# EAGLE design manga-screen (EAGLE 5.12)
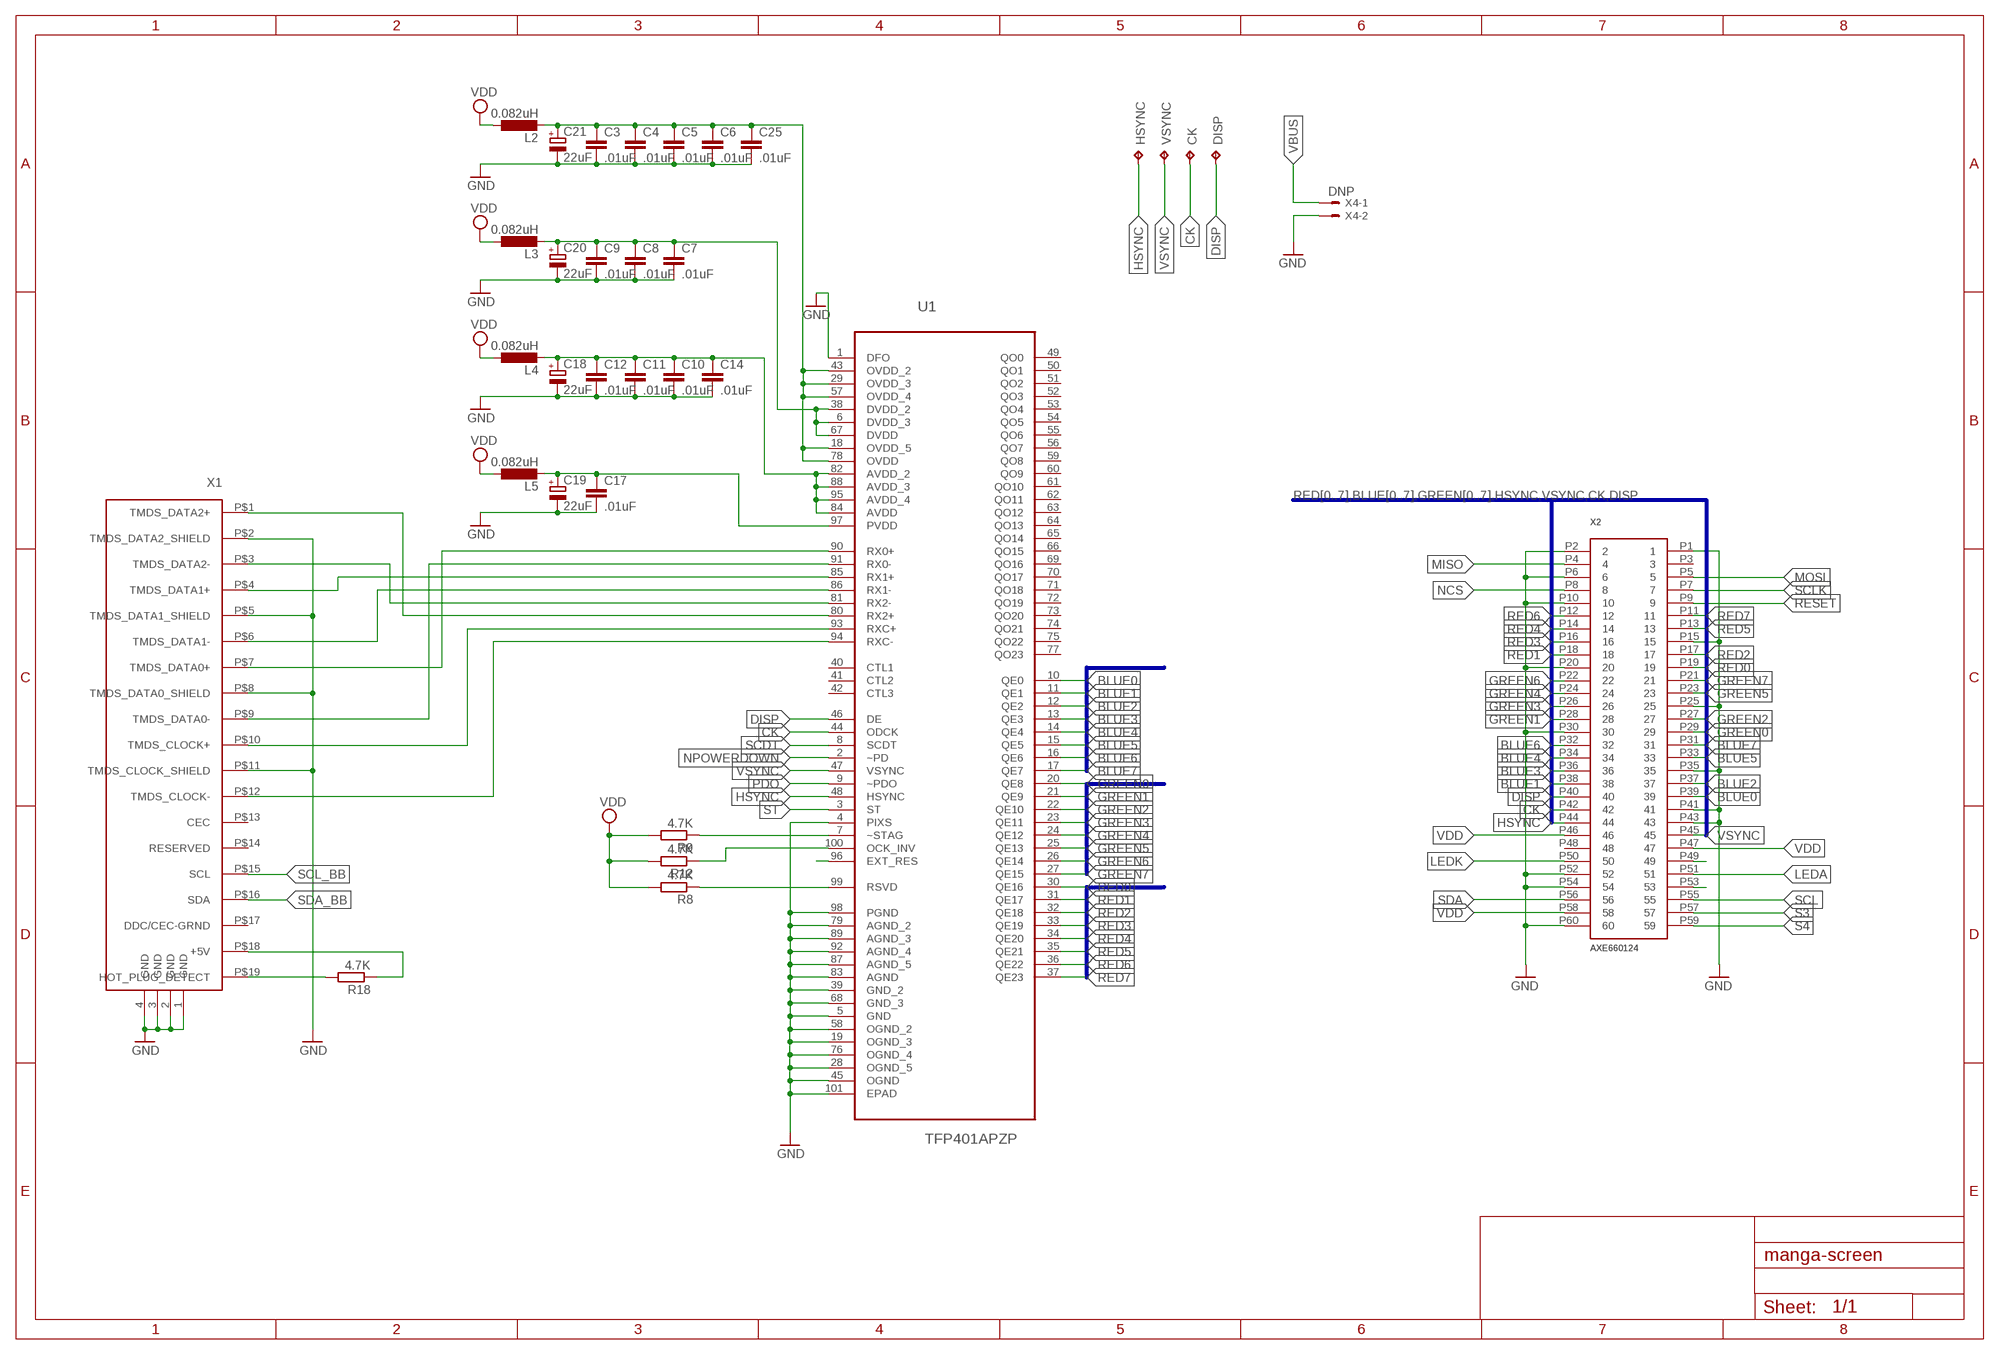
[diagram p0: schematic, sheet 1, part 1 of 2]
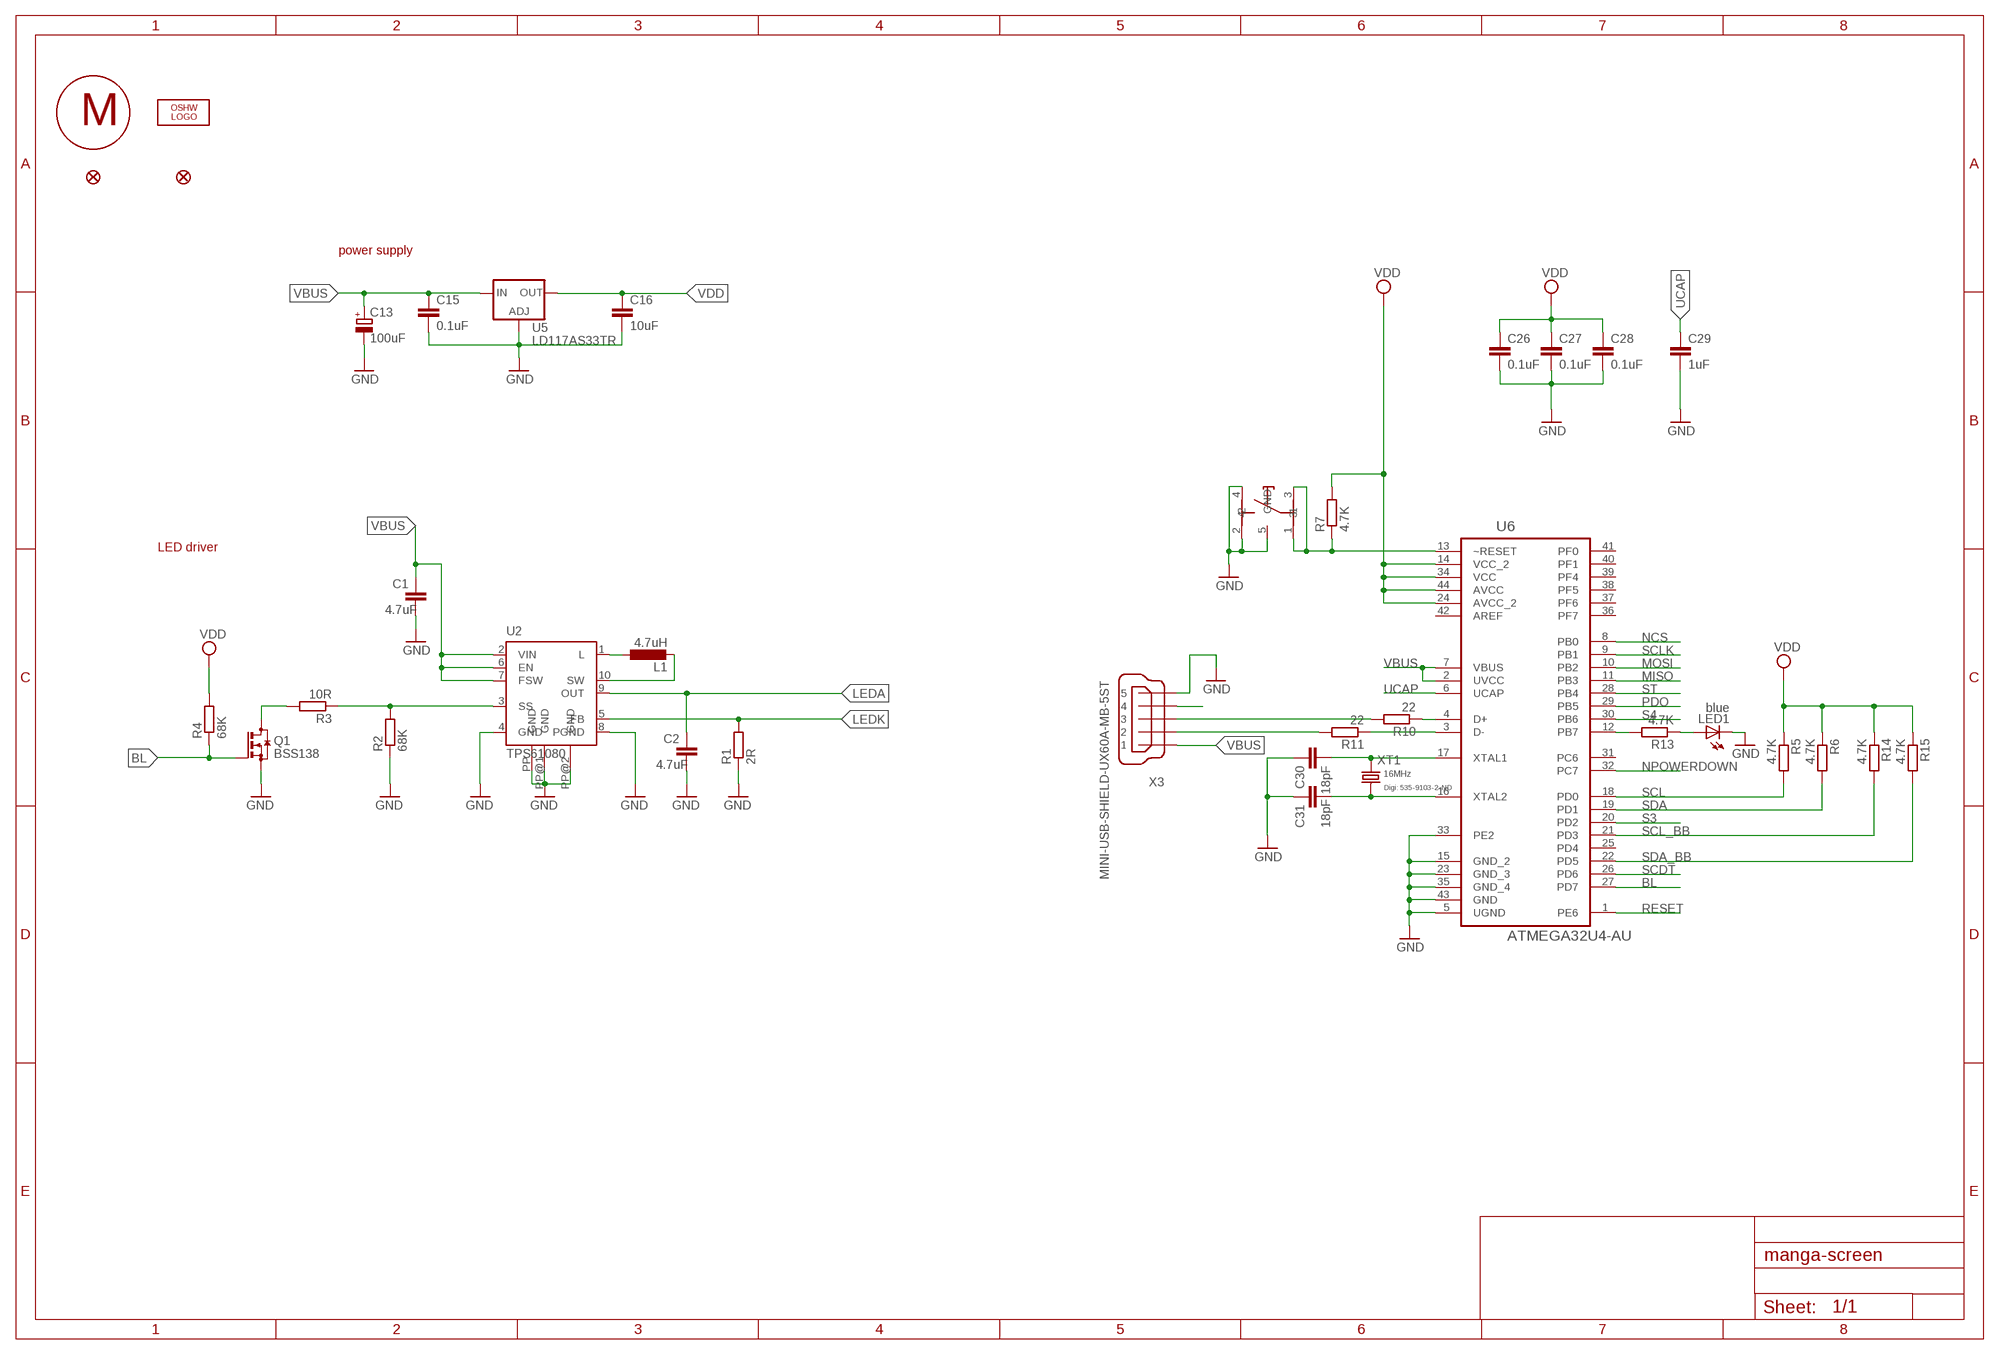
[diagram p1: schematic, sheet 1, part 2 of 2]

## Parts
C1  4.7uF  C-EUC0402  [C0402]
C2  4.7uF  C-EUC0402  [C0402]
C3  .01uF  C-EUC0402  [C0402]
C4  .01uF  C-EUC0402  [C0402]
C5  .01uF  C-EUC0402  [C0402]
C6  .01uF  C-EUC0402  [C0402]
C7  .01uF  C-EUC0402  [C0402]
C8  .01uF  C-EUC0402  [C0402]
C9  .01uF  C-EUC0402  [C0402]
C10  .01uF  C-EUC0402  [C0402]
C11  .01uF  C-EUC0402  [C0402]
C12  .01uF  C-EUC0402  [C0402]
C13  100uF  CPOL-EUB  [PANASONIC_B]
C14  .01uF  C-EUC0402  [C0402]
C15  0.1uF  C-EUC0402  [C0402]
C16  10uF  C-EUC0805  [C0805]
C17  .01uF  C-EUC0402  [C0402]
C18  22uF  CPOL-EUCT3216  [CT3216]
C19  22uF  CPOL-EUCT3216  [CT3216]
C20  22uF  CPOL-EUCT3216  [CT3216]
C21  22uF  CPOL-EUCT3216  [CT3216]
C25  .01uF  C-EUC0402  [C0402]
C26  0.1uF  C-EUC0402  [C0402]
C27  0.1uF  C-EUC0402  [C0402]
C28  0.1uF  C-EUC0402  [C0402]
C29  1uF  C-EUC0402  [C0402]
C30  18pF  C-EUC0402  [C0402]
C31  18pF  C-EUC0402  [C0402]
CK  TPB1,27  [B1,27]
DISP  TPB1,27  [B1,27]
HSYNC  TPB1,27  [B1,27]
JP1  FIDUCIAL1X2  [FIDUCIAL-1X2]
JP2  FIDUCIAL1X2  [FIDUCIAL-1X2]
L1  4.7uH  L-EUL2825P  [L2825P]
L2  0.082uH  L-EUL2012C  [L2012C]
L3  0.082uH  L-EUL2012C  [L2012C]
L4  0.082uH  L-EUL2012C  [L2012C]
L5  0.082uH  L-EUL2012C  [L2012C]
LED1  blue  LEDCHIP-LED0603  [CHIP-LED0603]
LOGO2  OSHW_LOGO_10MILX0200-NT  [OSHW_10X200_NOTEXT]
Q1  BSS138  BSS123  [SOT23]
R1  2R  R-EU_R0402  [R0402]
R2  68K  R-EU_R0402  [R0402]
R3  10R  R-EU_R0402  [R0402]
R4  68K  R-EU_R0402  [R0402]
R5  4.7K  R-EU_R0402  [R0402]
R6  4.7K  R-EU_R0402  [R0402]
R7  4.7K  R-EU_R0402  [R0402]
R8  4.7K  R-EU_R0402  [R0402]
R9  4.7K  R-EU_R0402  [R0402]
R10  22  R-EU_R0402  [R0402]
R11  22  R-EU_R0402  [R0402]
R12  4.7K  R-EU_R0402  [R0402]
R13  4.7K  R-EU_R0402  [R0402]
R14  4.7K  R-EU_R0402  [R0402]
R15  4.7K  R-EU_R0402  [R0402]
R18  4.7K  R-EU_R0402  [R0402]
S1  KRM_TACT_SWITCH  [KMR]
U1  TFP401APZP  [QFP50P1600X1600X120-101N]
U2  TPS61080  [S-PDSO-N10]
U5  LD117AS33TR  [SOT223]
U6  ATMEGA32U4-AU  [QFP80P1200X1200X120-44N]
U$2  MANGA-GRAPHIC  [MANGA]
VSYNC  TPB1,27  [B1,27]
X1  HDMI  [FCI-HDMI]
X2  AXE660124  AXE660124SOCKET  [AXE560124]
X3  MINI-USB-SHIELD-UX60A-MB-5ST  [UX60A-MB-5ST]
X4  DNP  22-27-2021-02  [6410-02]
XT1  16MHz  CRYSTAL-5.08X3.18  [2P-SMD-5.08X3.18]

## Nets
BL: Q1.1(G) R4.1 U6.27(PD7)
BLUE0: U1.10(QE0) X2.P39
BLUE1: U1.11(QE1) X2.P38
BLUE2: U1.12(QE2) X2.P37
BLUE3: U1.13(QE3) X2.P36
BLUE4: U1.14(QE4) X2.P34
BLUE5: U1.15(QE5) X2.P33
BLUE6: U1.16(QE6) X2.P32
BLUE7: U1.17(QE7) X2.P31
CK: CK.TP U1.44(ODCK) X2.P42
D+: R10.2 X3.3
D-: R11.2 X3.2
DISP: DISP.TP U1.46(DE) X2.P40
DM: R11.1 U6.3(D-)
DP: R10.1 U6.4(D+)
GND: C1.2 C2.2 C3.2 C4.2 C5.2 C6.2 C7.2 C8.2 C9.2 C10.2 C11.2 C12.2 C13.- C14.2 C15.2 C16.2 C17.2 C18.- C19.- C20.- C21.- C25.2 C26.2 C27.2 C28.2 C29.2 C30.1 C31.1 LED1.C Q1.2(S) R1.1 R2.1 S1.2 S1.4 S1.5(GND) U1.1(DFO) U1.4(PIXS) U1.5(GND) U1.19(OGND_3) U1.28(OGND_5) U1.39(GND_2) U1.45(OGND) U1.58(OGND_2) U1.68(GND_3) U1.76(OGND_4) U1.79(AGND_2) U1.83(AGND) U1.87(AGND_5) U1.89(AGND_3) U1.92(AGND_4) U1.98(PGND) U1.101(EPAD) U2.4(GND) U2.8(PGND) U2.PP(GND) U2.PP@1(GND) U2.PP@2(GND) U5.1(ADJ) U6.5(UGND) U6.15(GND_2) U6.23(GND_3) U6.33(PE2) U6.35(GND_4) U6.43(GND) X1.1(GND) X1.2(GND) X1.3(GND) X1.4(GND) X1.P$2(TMDS_DATA2_SHIELD) X1.P$5(TMDS_DATA1_SHIELD) X1.P$8(TMDS_DATA0_SHIELD) X1.P$11(TMDS_CLOCK_SHIELD) X2.P1 X2.P2 X2.P6 X2.P10 X2.P15 X2.P20 X2.P25 X2.P30 X2.P35 X2.P41 X2.P43 X2.P52 X2.P54 X2.P60 X3.5 X4.2
GREEN0: U1.20(QE8) X2.P29
GREEN1: U1.21(QE9) X2.P28
GREEN2: U1.22(QE10) X2.P27
GREEN3: U1.23(QE11) X2.P26
GREEN4: U1.24(QE12) X2.P24
GREEN5: U1.25(QE13) X2.P23
GREEN6: U1.26(QE14) X2.P22
GREEN7: U1.27(QE15) X2.P21
HSYNC: HSYNC.TP U1.48(HSYNC) X2.P44
LEDA: C2.1 U2.9(OUT) X2.P51
LEDK: R1.2 U2.5(FB) X2.P50
MISO: U6.11(PB3) X2.P4
MOSI: U6.10(PB2) X2.P5
N$1: L1.1 U2.1(L)
N$2: L1.2 U2.10(SW)
N$3: R12.1 U1.100(OCK_INV)
N$4: R2.2 R3.1 U2.3(SS)
N$6: Q1.3(D) R3.2
N$7: R7.1 S1.1 S1.3 U6.13(~RESET)
N$8: R13.2 U6.12(PB7)
N$9: LED1.A R13.1
N$10: R9.1 U1.7(~STAG)
N$11: R8.1 U1.99(RSVD)
N$12: X2.P53
N$13: X2.P49
N$14: C31.2 U6.16(XTAL2) XT1.X2
N$15: X3.4
N$16: C30.2 U6.17(XTAL1) XT1.X1
N$17: R18.1 X1.P$18(+5V)
N$19: C7.1 C8.1 C9.1 C20.+ L3.2 U1.6(DVDD_3) U1.38(DVDD_2) U1.67(DVDD)
N$20: C3.1 C4.1 C5.1 C6.1 C21.+ C25.1 L2.2 U1.18(OVDD_5) U1.29(OVDD_3) U1.43(OVDD_2) U1.57(OVDD_4) U1.78(OVDD)
N$21: C10.1 C11.1 C12.1 C14.1 C18.+ L4.2 U1.82(AVDD_2) U1.84(AVDD) U1.88(AVDD_3) U1.95(AVDD_4)
N$22: C17.1 C19.+ L5.2 U1.97(PVDD)
N$23: U1.96(EXT_RES)
N$31: R18.2 X1.P$19(HOT_PLUG_DETECT)
NCS: U6.8(PB0) X2.P8
NPOWERDOWN: U1.2(~PD) U6.32(PC7)
PDO: U1.9(~PDO) U6.29(PB5)
RED0: U1.30(QE16) X2.P19
RED1: U1.31(QE17) X2.P18
RED2: U1.32(QE18) X2.P17
RED3: U1.33(QE19) X2.P16
RED4: U1.34(QE20) X2.P14
RED5: U1.35(QE21) X2.P13
RED6: U1.36(QE22) X2.P12
RED7: U1.37(QE23) X2.P11
RESET: U6.1(PE6) X2.P9
S3: U6.20(PD2) X2.P57
S4: U6.30(PB6) X2.P59
SCDT: U1.8(SCDT) U6.26(PD6)
SCL: R5.2 U6.18(PD0) X2.P55
SCL_BB: R14.2 U6.21(PD3) X1.P$15(SCL)
SCLK: U6.9(PB1) X2.P7
SDA: R6.2 U6.19(PD1) X2.P56
SDA_BB: R15.2 U6.22(PD5) X1.P$16(SDA)
ST: U1.3(ST) U6.28(PB4)
TMDS_CLOCK+: U1.93(RXC+) X1.P$10(TMDS_CLOCK+)
TMDS_CLOCK-: U1.94(RXC-) X1.P$12(TMDS_CLOCK-)
TMDS_DATA0+: U1.90(RX0+) X1.P$7(TMDS_DATA0+)
TMDS_DATA0-: U1.91(RX0-) X1.P$9(TMDS_DATA0-)
TMDS_DATA1+: U1.85(RX1+) X1.P$4(TMDS_DATA1+)
TMDS_DATA1-: U1.86(RX1-) X1.P$6(TMDS_DATA1-)
TMDS_DATA2+: U1.80(RX2+) X1.P$1(TMDS_DATA2+)
TMDS_DATA2-: U1.81(RX2-) X1.P$3(TMDS_DATA2-)
UCAP: C29.1 U6.6(UCAP)
VBUS: C1.1 C13.+ C15.1 U2.2(VIN) U2.6(EN) U2.7(FSW) U5.3(IN) U6.2(UVCC) U6.7(VBUS) X3.1 X4.1
VDD: C16.1 C26.1 C27.1 C28.1 L2.1 L3.1 L4.1 L5.1 R4.2 R5.1 R6.1 R7.2 R8.2 R9.2 R12.2 R14.1 R15.1 U5.4(OUT) U6.14(VCC_2) U6.24(AVCC_2) U6.34(VCC) U6.44(AVCC) X2.P46 X2.P47 X2.P58
VSYNC: U1.47(VSYNC) VSYNC.TP X2.P45
Unconnected: U1.40(CTL1) U1.41(CTL2) U1.42(CTL3) U1.49(QO0) U1.50(QO1) U1.51(QO2) U1.52(QO3) U1.53(QO4) U1.54(QO5) U1.55(QO6) U1.56(QO7) U1.59(QO8) U1.60(QO9) U1.61(QO10) U1.62(QO11) U1.63(QO12) U1.64(QO13) U1.65(QO14) U1.66(QO15) U1.69(QO16) U1.70(QO17) U1.71(QO18) U1.72(QO19) U1.73(QO20) U1.74(QO21) U1.75(QO22) U1.77(QO23) U6.25(PD4) U6.31(PC6) U6.36(PF7) U6.37(PF6) U6.38(PF5) U6.39(PF4) U6.40(PF1) U6.41(PF0) U6.42(AREF) X1.P$13(CEC) X1.P$14(RESERVED) X1.P$17(DDC/CEC-GRND) X2.P3 X2.P48 X3.M1(S1) X3.M2(S2) X3.M3(S3) X3.M4(S4)

## Buses
RED[0..7],BLUE[0..7],GREEN[0..7],HSYNC,VSYNC,CK,DISP
RED[0..7]
GREEN[0..7]
BLUE[0..7]

## Notes on the sheet
- power supply
- LED driver
- Digi: 535-9103-2-ND

## Library data of the parts
C1-C12 C14-C17 C25-C31 = rcl:C-EU: CAPACITOR, European symbol
C13 C18-C21 = rcl:CPOL-EU: POLARIZED CAPACITOR, European symbol
CK DISP HSYNC VSYNC = testpad:TP: Test pad
JP1 JP2 = SparkFun:FIDUCIAL: Fiducial Alignment Points Various fiducial points for machine vision alignment.
L1-L5 = rcl:L-EU: INDUCTOR, European symbol
LED1 = led:LED: LED OSRAM: - CHIPLED LG R971, LG N971, LY N971, LG Q971, LY Q971, LO R971, LY R971 LH N974, LH R974 LS Q976, LO Q976, LY Q976 LO Q996 - Hyper CHIPLED LW Q18S LB Q993, LB Q99A, LB R99A - SideLED LS A670, LO A670, LY A670, LG A670, LP A670 LB A673, LV A673, LT A673, LW A673 LH A674 LY A675 LS A676, LA A676, LO A676, LY A676, LW A676 LS A679, LY A679, LG A679 - Hyper Micro SIDELED® LS Y876, LA Y876, LO Y876, LY Y876 LT Y87S - SmartLED LW L88C, LW L88S LB L89C, LB L89S, LG L890 LS L89K, LO L89K, LY L89K LS L896, LA L896, LO L896, LY L896 - TOPLED LS T670, LO T670, LY T670, LG T670, LP T670 LSG T670, LSP T670, LSY T670, LOP T670, LYG T670 LG T671, LOG T671, LSG T671 LB T673, LV T673, LT T673, LW T673 LH T674 LS T676, LA T676, LO T676, LY T676, LB T676, LH T676, LSB T676, LW T676 LB T67C, LV T67C, LT T67C, LS T67K, LO T67K, LY T67K, LW E67C LS E67B, LA E67B, LO E67B, LY E67B, LB E67C, LV E67C, LT E67C LW T67C LS T679, LY T679, LG T679 LS T770, LO T770, LY T770, LG T770, LP T770 LB T773, LV T773, LT T773, LW T773 LH T774 LS E675, LA E675, LY E675, LS T675 LS T776, LA T776, LO T776, LY T776, LB T776 LHGB T686 LT T68C, LB T68C - Hyper Mini TOPLED® LB M676 - Mini TOPLED Santana® LG M470 LS M47K, LO M47K, LY M47K Source: http://www.osram.convergy.de LUXEON: - LUMILED® LXK2-PW12-R00, LXK2-PW12-S00, LXK2-PW14-U00, LXK2-PW14-V00 LXK2-PM12-R00, LXK2-PM12-S00, LXK2-PM14-U00 LXK2-PE12-Q00, LXK2-PE12-R00, LXK2-PE12-S00, LXK2-PE14-T00, LXK2-PE14-U00 LXK2-PB12-K00, LXK2-PB12-L00, LXK2-PB12-M00, LXK2-PB14-N00, LXK2-PB14-P00, LXK2-PB14-Q00 LXK2-PR12-L00, LXK2-PR12-M00, LXK2-PR14-Q00, LXK2-PR14-R00 LXK2-PD12-Q00, LXK2-PD12-R00, LXK2-PD12-S00 LXK2-PH12-R00, LXK2-PH12-S00 LXK2-PL12-P00, LXK2-PL12-Q00, LXK2-PL12-R00 Source: www.luxeon.com KINGBRIGHT: KA-3528ASYC Source: www.kingbright.com
LOGO2 = ohw-logo:OSHW_LOGO_10MIL
Q1 = transistor-small-signal:BSS123: N-CHANNEL MOS FET
R1-R6 R8-R15 R18 = rcl:R-EU_: RESISTOR, European symbol
R7 = resistor:R-EU_: RESISTOR, European symbol
S1 = custom:KRM_TACT_SWITCH: KRM tact switch http://no.farnell.com/c-k-components/kmr241g-lfs/tactile-switch-smd-4n/dp/1437637
U1 = ti-tfp401:TFP401APZP: DIGITAL RECEIVER; MPN: TFP401APZP; OC_FARNELL: 1470430; OC_NEWARK: 74K3959; PACKAGE: QFP-100; SUPPLIER: TEXAS INSTRUMENTS
U2 = texas:TPS6108*: HIGH VOLTAGE DC/DC BOOST CONVERTER WITH 0.5-A/1.3-A INTEGRATED SWITCH Source: www.ti.com .. tps61081[1].pdf; MPN: TPS61080DRCT; OC_FARNELL: 1412517; OC_NEWARK: 30M1831
U5 = v-reg:LD117A?*: Low drop fixed and adjustable positive voltage regulators 1 A Source: http://www.st.com/stonline/products/literature/ds/7194/ld1117axx.pdf
U6 = atmega32u4:ATMEGA32U4-AU: 8-bit Microcontroller with ISP Flash and USB Controller; MPN: ATMEGA32U4-AU; OC_FARNELL: 1748525; OC_NEWARK: 26R5633; PACKAGE: TQFP-44; SUPPLIER: Atmel
U$2 = manga:MANGA-GRAPHIC
X1 = hdmi:HDMI
X2 = replicape-display:AXE660124
X3 = con-hirose:MINI-USB-SHIELD-: MINI USB Connector Source: http://www.hirose.co.jp/cataloge_hp/e24000019.pdf; OC_FARNELL: unknown; OC_NEWARK: unknown
X4 = con-molex:22-?-02: CONNECTOR wire to board 2.54 mm (.1 inch) pitch header; OC_FARNELL: unknown; OC_NEWARK: unknown
XT1 = Seeed-Discrete:CRYSTAL*: CRYSTAL

## Board
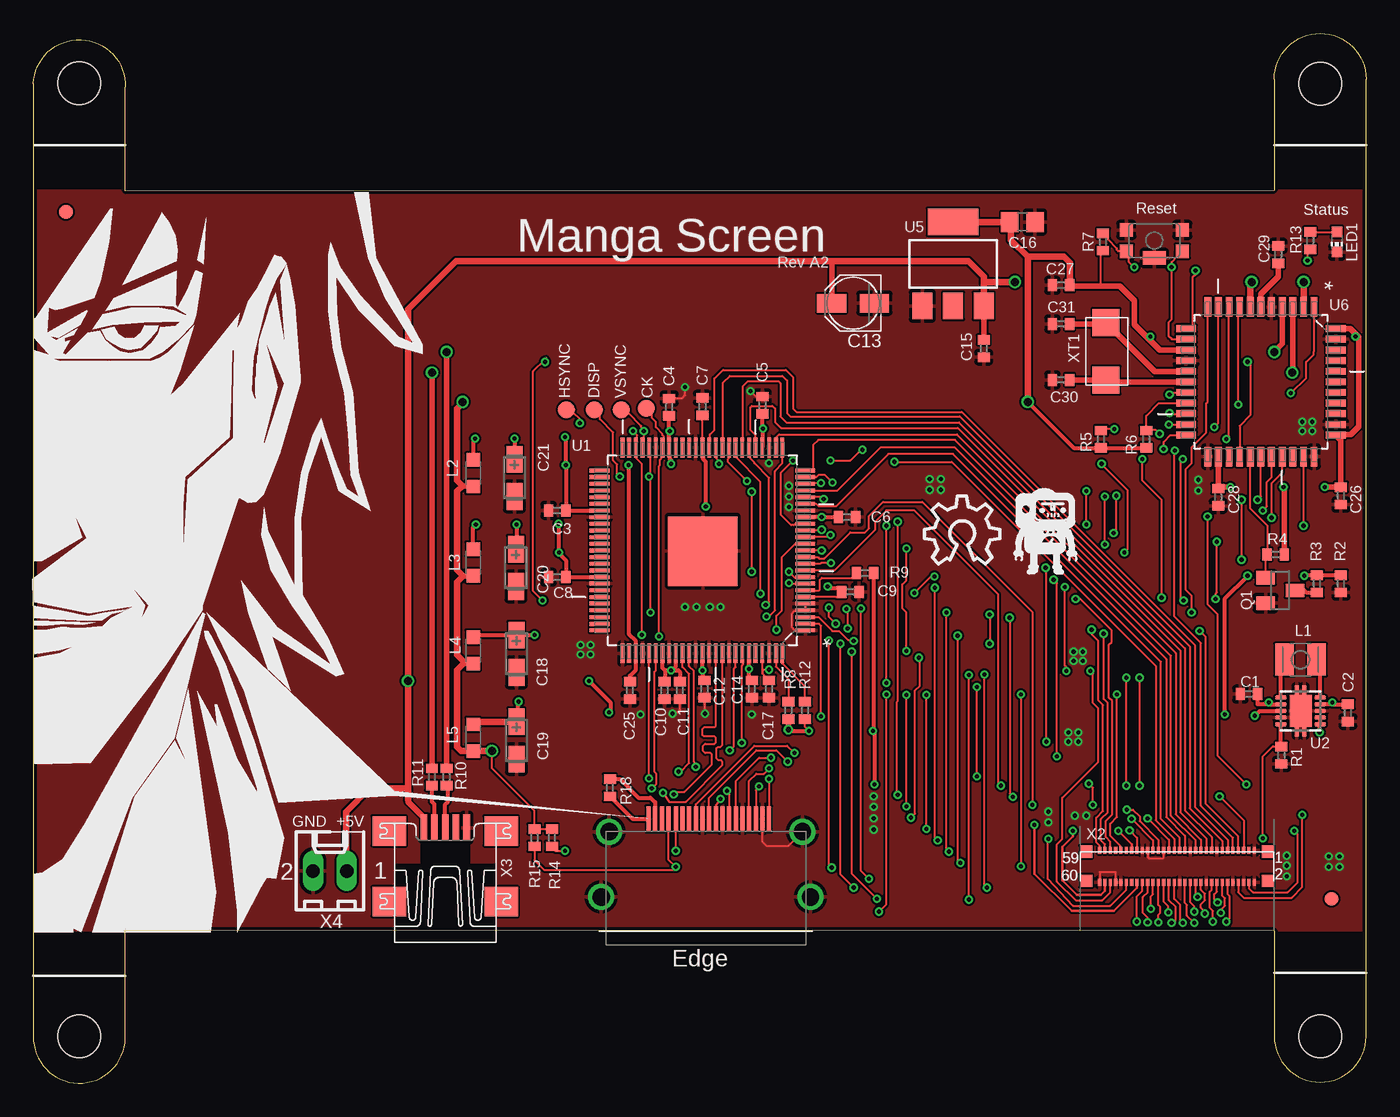
[diagram p2: board, top side]
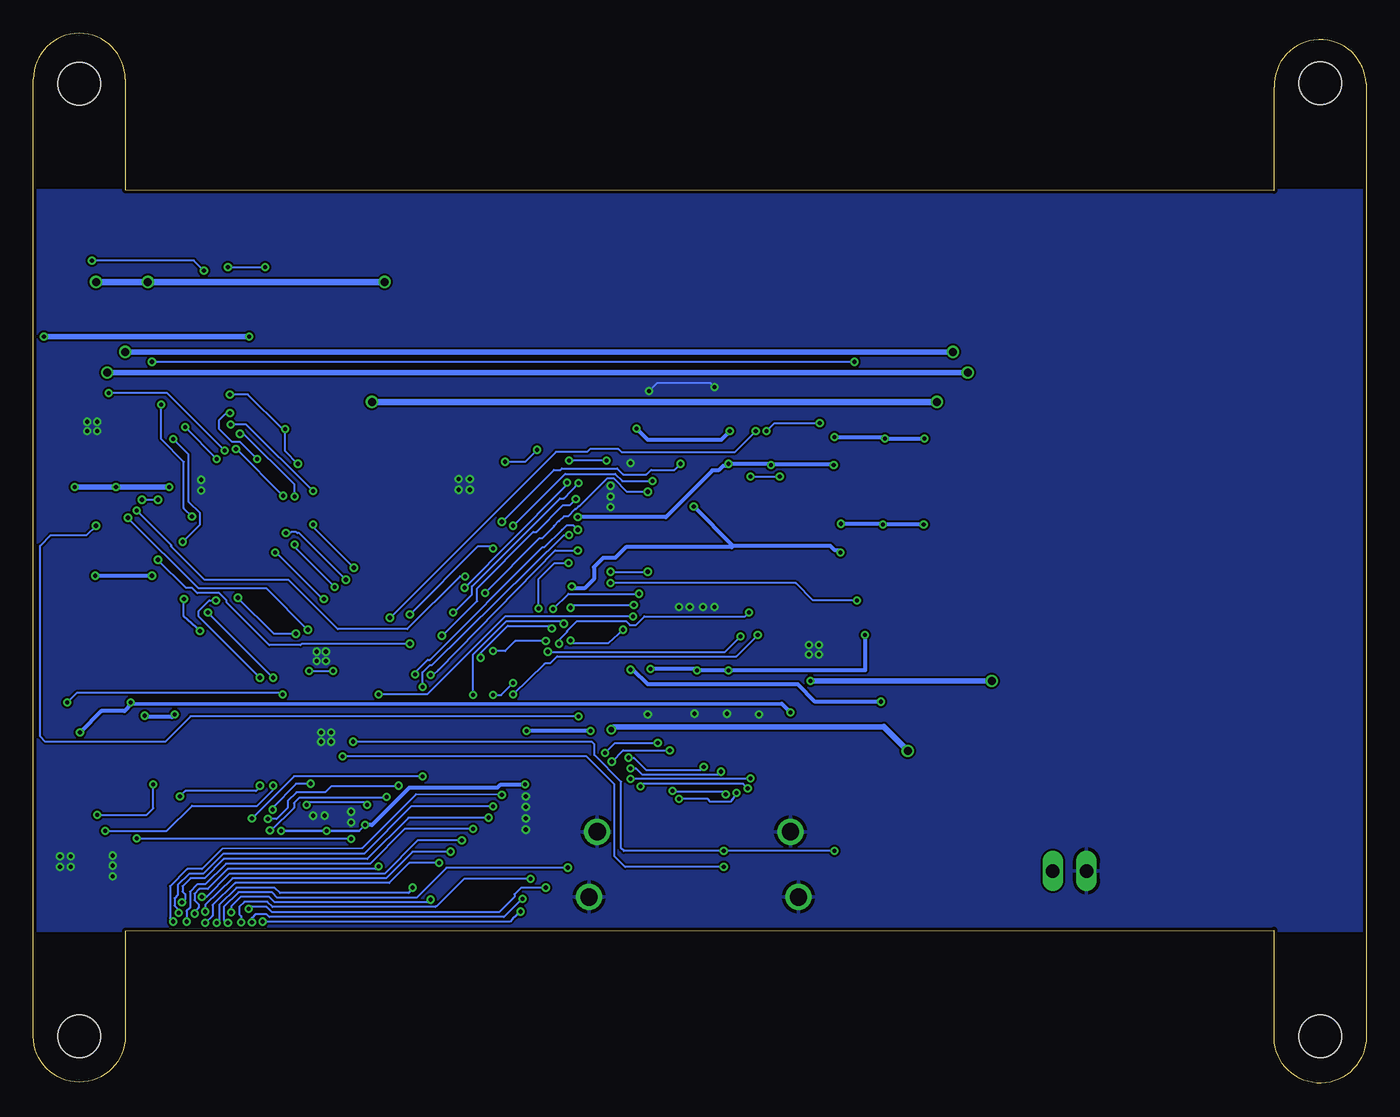
[diagram p3: board, bottom side, seen from below]

Size 100 x 78.78 mm. Coordinates in mm from the lower left corner, seen from the top.
Outline: 6.9,3.38 6.9,11.48 93.1,11.43 93.1,3.53 arc180 100,3.53 100,75.33 arc180 93.1,75.33 93.1,67.03 6.9,66.98 6.9,74.73 arc180 0,74.98 0,3.53 arc180 6.9,3.38
Copper layers (1*16): Top 0.035mm / dielectric 1.5mm / Bottom 0.035mm
Design rules "Fusion_eagle_rule_v1.1": minimum track width 6mil, minimum drill 12mil, track to track 6mil, track to pad 6mil, pad to pad 6mil, via to via 6mil, smd to smd 0mil, copper to edge 10mil, drill to drill 10mil, minimum pad ring 10mil, minimum via ring 6mil, stop-mask expansion 2mil, vias tented up to drill 100mil, thermal gap 10mil
Holes 3.2 mm at 3.45,75.03 3.45,3.53 96.55,74.98 96.55,3.53

### Footprints (pad centres in the part's own frame; a part is rotated, then mirrored left to right if it is on the bottom)
C0402 = smd 0.7 x 0.9: 1 -0.65,0; 2 0.65,0
PANASONIC_B = smd 2.2 x 1.4: + 1.6,0; - -1.6,0
C0805 = smd 1.3 x 1.5: 1 -0.95,0; 2 0.95,0
CT3216 = smd 2 x 1.2: + -1.4,0; - 1.4,0
B1,27 = smd 1.27 x 1.27: TP 0,0
FIDUCIAL-1X2 = smd 1 x 1: 1 0,0
L2825P = smd 1.4 x 2.4: 1 -1.2,0; 2 1.2,0
L2012C = smd 1 x 1: 1 -1,0; 2 1,0
CHIP-LED0603 = smd 0.8 x 0.8: A 0,-0.75; C 0,0.75
SOT23 = smd 1 x 1.4: 1 -0.95,-1.1; 2 0.95,-1.1; 3 0,1.1
R0402 = smd 0.7 x 0.9: 1 -0.65,0; 2 0.65,0
KMR = smd 1 x 1: 1 2.1,0.8; 2 2.1,-0.8; 3 -2.1,0.8; 4 -2.1,-0.8 | smd 1.7 x 1: 5 0,1.3
QFP50P1600X1600X120-101N = smd 1.473 x 0.279: 1 -7.722,5.994; 2 -7.722,5.512; 3 -7.722,5.004; 4 -7.722,4.496; 5 -7.722,3.988; 6 -7.722,3.505; 7 -7.722,2.997; 8 -7.722,2.489; 9 -7.722,2.007; 10 -7.722,1.499; 11 -7.722,0.991; 12 -7.722,0.508; 13 -7.722,0; 14 -7.722,-0.508; 15 -7.722,-0.991; 16 -7.722,-1.499; 17 -7.722,-2.007; 18 -7.722,-2.489; 19 -7.722,-2.997; 20 -7.722,-3.505; 21 -7.722,-3.988; 22 -7.722,-4.496; 23 -7.722,-5.004; 24 -7.722,-5.512; 25 -7.722,-5.994; 51 7.722,-5.994; 52 7.722,-5.512; 53 7.722,-5.004; 54 7.722,-4.496; 55 7.722,-3.988; 56 7.722,-3.505; 57 7.722,-2.997; 58 7.722,-2.489; 59 7.722,-2.007; 60 7.722,-1.499; 61 7.722,-0.991; 62 7.722,-0.508; 63 7.722,0; 64 7.722,0.508; 65 7.722,0.991; 66 7.722,1.499; 67 7.722,2.007; 68 7.722,2.489; 69 7.722,2.997; 70 7.722,3.505; 71 7.722,3.988; 72 7.722,4.496; 73 7.722,5.004; 74 7.722,5.512; 75 7.722,5.994 | smd 0.279 x 1.473: 26 -5.994,-7.722; 27 -5.512,-7.722; 28 -5.004,-7.722; 29 -4.496,-7.722; 30 -3.988,-7.722; 31 -3.505,-7.722; 32 -2.997,-7.722; 33 -2.489,-7.722; 34 -2.007,-7.722; 35 -1.499,-7.722; 36 -0.991,-7.722; 37 -0.508,-7.722; 38 0,-7.722; 39 0.508,-7.722; 40 0.991,-7.722; 41 1.499,-7.722; 42 2.007,-7.722; 43 2.489,-7.722; 44 2.997,-7.722; 45 3.505,-7.722; 46 3.988,-7.722; 47 4.496,-7.722; 48 5.004,-7.722; 49 5.512,-7.722; 50 5.994,-7.722; 76 5.994,7.722; 77 5.512,7.722; 78 5.004,7.722; 79 4.496,7.722; 80 3.988,7.722; 81 3.505,7.722; 82 2.997,7.722; 83 2.489,7.722; 84 2.007,7.722; 85 1.499,7.722; 86 0.991,7.722; 87 0.508,7.722; 88 0,7.722; 89 -0.508,7.722; 90 -0.991,7.722; 91 -1.499,7.722; 92 -2.007,7.722; 93 -2.489,7.722; 94 -2.997,7.722; 95 -3.505,7.722; 96 -3.988,7.722; 97 -4.496,7.722; 98 -5.004,7.722; 99 -5.512,7.722; 100 -5.994,7.722 | smd 5.207 x 5.207: 101 -0.025,0.051
S-PDSO-N10 = smd 0.28 x 0.85: 1 -1,-1.475; 2 -0.5,-1.475; 3 0,-1.475; 4 0.5,-1.475; 5 1,-1.475; 6 1,1.475; 7 0.5,1.475; 8 0,1.475; 9 -0.5,1.475; 10 -1,1.475 | smd 2.4 x 1.65: PP 0,0 | smd 3.8 x 0.28: PP@1 0,0.275; PP@2 0,-0.275
SOT223 = smd 1.5 x 2: 1 -2.3,-3.15; 2 0,-3.15; 3 2.3,-3.15 | smd 3.8 x 2: 4 0,3.15
QFP80P1200X1200X120-44N = smd 1.473 x 0.508: 1 -5.613,3.988; 2 -5.613,3.2; 3 -5.613,2.388; 4 -5.613,1.6; 5 -5.613,0.787; 6 -5.613,0; 7 -5.613,-0.787; 8 -5.613,-1.6; 9 -5.613,-2.388; 10 -5.613,-3.2; 11 -5.613,-3.988; 23 5.613,-3.988; 24 5.613,-3.2; 25 5.613,-2.388; 26 5.613,-1.6; 27 5.613,-0.787; 28 5.613,0; 29 5.613,0.787; 30 5.613,1.6; 31 5.613,2.388; 32 5.613,3.2; 33 5.613,3.988 | smd 0.508 x 1.473: 12 -3.988,-5.613; 13 -3.2,-5.613; 14 -2.388,-5.613; 15 -1.6,-5.613; 16 -0.787,-5.613; 17 0,-5.613; 18 0.787,-5.613; 19 1.6,-5.613; 20 2.388,-5.613; 21 3.2,-5.613; 22 3.988,-5.613; 34 3.988,5.613; 35 3.2,5.613; 36 2.388,5.613; 37 1.6,5.613; 38 0.787,5.613; 39 0,5.613; 40 -0.787,5.613; 41 -1.6,5.613; 42 -2.388,5.613; 43 -3.2,5.613; 44 -3.988,5.613
FCI-HDMI = drill 1.3 round: 1 1.1,7.85; 2 -3.8,7.25; 3 1.1,-7.85; 4 -3.8,-7.25 | smd 1.9 x 0.3: P$1 -4.76,4.75; P$2 -4.76,4.25; P$3 -4.76,3.75; P$4 -4.76,3.25; P$5 -4.76,2.75; P$6 -4.76,2.25; P$7 -4.76,1.75; P$8 -4.76,1.25; P$9 -4.76,0.75; P$10 -4.76,0.25; P$11 -4.76,-0.25; P$12 -4.76,-0.75; P$13 -4.76,-1.25; P$14 -4.76,-1.75; P$15 -4.76,-2.25; P$16 -4.76,-2.8; P$17 -4.76,-3.3; P$18 -4.76,-3.8; P$19 -4.76,-4.3
AXE560124 = smd 0.9 x 0.92: 1 -6.8,1.1; 2 -6.8,-1.1; 3 6.8,1.1; 4 6.8,-1.1 | smd 0.23 x 0.5: P1 5.8,1.2; P2 5.8,-1.2; P3 5.4,1.2; P4 5.4,-1.2; P5 5,1.2; P6 5,-1.2; P7 4.6,1.2; P8 4.6,-1.2; P9 4.2,1.2; P10 4.2,-1.2; P11 3.8,1.2; P12 3.8,-1.2; P13 3.4,1.2; P14 3.4,-1.2; P15 3,1.2; P16 3,-1.2; P17 2.6,1.2; P18 2.6,-1.2; P19 2.2,1.2; P20 2.2,-1.2; P21 1.8,1.2; P22 1.8,-1.2; P23 1.4,1.2; P24 1.4,-1.2; P25 1,1.2; P26 1,-1.2; P27 0.6,1.2; P28 0.6,-1.2; P29 0.2,1.2; P30 0.2,-1.2; P31 -0.2,1.2; P32 -0.2,-1.2; P33 -0.6,1.2; P34 -0.6,-1.2; P35 -1,1.2; P36 -1,-1.2; P37 -1.4,1.2; P38 -1.4,-1.2; P39 -1.8,1.2; P40 -1.8,-1.2; P41 -2.2,1.2; P42 -2.2,-1.2; P43 -2.6,1.2; P44 -2.6,-1.2; P45 -3,1.2; P46 -3,-1.2; P47 -3.4,1.2; P48 -3.4,-1.2; P49 -3.8,1.2; P50 -3.8,-1.2; P51 -4.2,1.2; P52 -4.2,-1.2; P53 -4.6,1.2; P54 -4.6,-1.2; P55 -5,1.2; P56 -5,-1.2; P57 -5.4,1.2; P58 -5.4,-1.2; P59 -5.8,1.2; P60 -5.8,-1.2
UX60A-MB-5ST = smd 2 x 0.5: 1 2.25,1.6; 2 2.25,0.8; 3 2.25,0; 4 2.25,-0.8; 5 2.25,-1.6 | smd 2.2 x 2.5: M1 -3.3,-4.2; M2 -3.3,4.2; M3 2,4.2; M4 2,-4.2
6410-02 = drill 1.016 long: 1 1.27,0; 2 -1.27,0
2P-SMD-5.08X3.18 = smd 2.032 x 2.032: X1 0.381,-1.524; X2 4.699,-1.524

### Placement (x,y rotation side)
C1  91.21,29.2 180 top
C2  98.63,27.78 270 top
C3  39.3,42.98 180 top
C4  47.7,50.73 90 top
C5  54.7,50.88 90 top
C6  61.05,42.48 0 top
C7  50.2,50.78 90 top
C8  39.3,37.98 180 top
C9  61.3,36.88 0 top
C10  47.35,29.47 270 top
C11  48.5,29.47 270 top
C12  50.35,29.57 270 top
C13  61.5,58.53 180 top
C14  53.9,29.57 270 top
C15  71.3,55.12 270 top
C16  74.2,64.62 0 top
C17  55.2,29.57 270 top
C18  36.25,32.23 270 top
C19  36.25,25.72 270 top
C20  36.2,38.68 270 top
C21  36.1,45.43 270 top
C25  44.75,29.47 270 top
C26  98.1,44.08 270 top
C27  77.1,59.88 180 top
C28  88.9,43.98 270 top
C29  93.4,62.18 90 top
C30  77.1,52.78 0 top
C31  77.1,56.98 0 top
CK  46,50.62 0 top
DISP  42.1,50.53 0 top
HSYNC  40,50.53 0 top
JP1  2.45,65.38 0 top
JP2  97.4,13.82 0 top
L1  95.08,31.78 0 top
L2  33,45.78 90 top
L3  33,39.08 90 top
L4  33,32.48 90 top
L5  33,25.93 90 top
LED1  97.8,63.12 180 top
LOGO2  66.85,38.98 0 top
Q1  93.55,36.98 270 top
R1  93.64,24.6 90 top
R2  98.1,37.48 90 top
R3  96.3,37.48 270 top
R4  93.2,39.68 0 top
R5  80.1,48.33 90 top
R6  83.5,48.33 90 top
R7  80.25,63.12 270 top
R8  56.65,27.97 270 top
R9  62.4,38.28 0 top
R10  31,22.97 270 top
R11  29.9,22.97 270 top
R12  57.9,27.97 270 top
R13  95.8,63.23 270 top
R14  38.9,18.43 270 top
R15  37.6,18.43 270 top
R18  43.25,22.18 270 top
S1  84.1,63.23 180 top
U1  50.2,39.98 180 top
U2  95.08,27.93 270 top
U5  69,61.48 0 top
U6  92.1,52.62 270 top
U$2  0,11.23 0 top
U$3  [LOGO_BIG]  75.5,41.48 0 top
VSYNC  44.1,50.53 270 top
X1  50.45,15.07 270 top
X2  85.8,16.27 0 top
X3  30.9,16.93 90 top
X4  22.25,15.93 0 top
XT1  78.95,52.38 90 top

### Tracks (layer width: path | path; a pad name or v marks a point on that pad's centre or on a via)
BL
  Top 0.152: Q1.1 92.45,39.58 R4.1 92.6,39.73 92.6,41.83 91.3,43.12 91.3,46.93 U6.27
BLUE0  (via drill 0.3)
  Top 0.152: X2.P39 84,18.22 v82.4,19.82 | v72.6,22.32 72.4,22.52 72.4,36.68 66.1,42.98 64,42.98 63.15,42.12 63.15,41.53 60.1,38.48 57.95,38.48 U1.10
  Bottom 0.152: v82.4,19.82 81.75,19.82 80.9,20.68 80.9,21.18 80.25,21.82 78.1,21.82 77.65,22.27 72.65,22.27 v72.6,22.32
BLUE1  (via drill 0.3)
  Top 0.152: X2.P38 84.4,13.38 84.55,13.23 84.55,12.77 84.4,12.62 v84.4,12.07 | 57.95,38.98 U1.11 58,38.98 59,38.98 59.1,39.03 v59.85,39.03 | v62.1,35.62 62.1,15.93 v62.7,15.32
  Bottom 0.152: v84.4,12.07 84.4,12.52 84.55,12.68 84.55,13.23 84.15,13.62 82.45,13.62 82.05,13.23 69.85,13.23 69.8,13.27 69.75,13.27 67.7,15.32 v62.7,15.32 | v59.85,39.03 60.9,39.03 62.1,37.83 v62.1,35.62
BLUE2  (via drill 0.3)
  Top 0.152: X2.P37 84.4,18.27 83,19.68 83,20.02 82.5,20.52 v82.05,20.52 | v79.5,20.88 79.5,22.18 v79.2,22.47 | U1.12 57.95,39.48 58.85,39.48 58.95,39.38 59.35,39.38 61.3,41.33 62.4,41.33 62.7,41.62 62.7,42.58 63.75,43.62 66.7,43.62 74.95,35.38 v74.95,20.88
  Bottom 0.152: v82.05,20.52 82.05,20.68 80.3,22.47 v79.2,22.47 | v74.95,20.88 75.15,21.07 79.3,21.07 v79.5,20.88
BLUE3  (via drill 0.3)
  Top 0.152: X2.P36 84.8,13.62 85.15,13.27 v85.15,12.82 | v59.15,39.98 U1.13 | v70.2,13.77 v70.2,30.62
  Bottom 0.152: v85.15,12.82 85.15,13.27 84.45,13.98 82.3,13.98 81.9,13.57 70.4,13.57 v70.2,13.77 | v59.15,39.98 60.85,39.98 69.6,31.02 70,30.62 v70.2,30.62
BLUE4  (via drill 0.3)
  Top 0.152: X2.P34 85.2,13.73 85.7,13.23 85.7,12.27 v85.4,12.02 | v55.75,34.03 55.75,35.08 56.15,35.48 56.15,39.48 57.15,40.48 57.9,40.48 U1.14 | v59.7,33.23 59.7,16.38 v59.9,16.18
  Bottom 0.152: v85.4,12.02 85.7,12.27 85.7,13.23 84.6,14.32 82.1,14.32 81.7,13.93 71.25,13.93 69,16.18 v59.9,16.18 | v59.7,33.23 59.5,33.03 56.85,33.03 v55.75,34.03
BLUE5  (via drill 0.3)
  Top 0.152: U1.15 59.64,40.97 v59.8,41.12 | v70.8,23.02 v70.8,29.72 | v83.6,19.88 85.2,18.27 X2.P33
  Bottom 0.152: v59.8,41.12 60.2,41.12 70.1,31.38 70.25,31.38 70.8,30.82 v70.8,29.72 | v70.8,23.02 80.45,23.02 v83.6,19.88
BLUE6  (via drill 0.3)
  Top 0.152: X2.P32 85.6,13.82 86.05,13.38 86.05,12.23 v86.25,12.02 | v59.15,41.53 59.1,41.48 57.95,41.48 U1.16 | v71.35,30.68 71.35,14.73 v71.55,14.68
  Bottom 0.152: v86.25,12.02 86.05,12.23 86.05,13.38 84.75,14.68 81.9,14.68 81.5,14.27 71.85,14.27 v71.55,14.68 | v59.15,41.53 59.5,41.88 59.95,41.88 60.35,41.53 61.65,40.23 61.8,40.23 70.25,31.77 70.4,31.77 71.35,30.82 v71.35,30.68
BLUE7  (via drill 0.3)
  Top 0.152: U1.17 57.9,41.98 57.15,41.98 57.05,41.88 56.85,41.88 56.1,42.62 56.1,45.83 v57,46.73 | X2.P31 85.6,18.32 84.2,19.72 84.2,31.32 68.9,46.62 v64.6,46.62 | v62.2,47.53 62.1,47.53 61.3,46.73 v59.8,46.73
  Bottom 0.152: v64.6,46.62 63.1,46.62 v62.2,47.53 | v57,46.73 v59.8,46.73
CK  (via drill 0.3)
  Top 0.152: X2.P42 83.6,14.32 83.25,13.98 83.25,12.77 83.6,12.43 v83.6,12.07 | v46.95,33.53 46.95,46.33 47,46.38 47,46.78 47.2,46.98 47.2,47.68 U1.44 47.3,47.73 47.3,48.53 47.2,48.62 47.2,48.73 46.7,49.23 46.7,49.62 46.4,49.93 46.4,50.62 CK.TP | v61.4,32.38 61.4,15.73 v63.3,13.82
  Bottom 0.152: v83.6,12.07 83.6,12.43 83.35,12.68 82.5,12.68 82.3,12.48 64.7,12.48 63.35,13.82 v63.3,13.82 | v61.4,32.38 48.1,32.38 v46.95,33.53 46.95,33.58
D+
  Top 0.305: X3.3 30.9,20.93 31.1,21.12 31.1,22.22 R10.2
D-
  Top 0.305: X3.2 30.1,20.93 29.9,21.12 R11.2
DISP  (via drill 0.3)
  Top 0.152: v83.85,13.07 83.85,14.02 84,14.18 X2.P40 | 46.3,46.88 46.2,46.98 46.2,47.68 U1.46 46.3,47.61 46.3,45.53 | v60.55,32.98 60.55,15.68 v61.55,14.68 | v46.3,35.33 46.3,45.53 | DISP.TP 42.5,50.53 42.5,49.83 43.5,48.83 43.5,46.73 43.8,46.43 43.8,45.73 v44,45.53 | 46.3,45.53 v46.2,45.53
  Bottom 0.152: v83.85,13.07 83.85,13.23 82.5,13.23 82.1,12.82 65.05,12.82 63.9,13.98 63.9,14.18 63.4,14.68 v61.55,14.68 | v60.55,32.98 60.55,33.28 59.95,33.88 59.95,33.93 59.2,34.68 55.55,34.68 55.25,34.38 54.8,34.38 54.15,35.03 46.6,35.03 v46.3,35.33 | v46.2,45.53 v44,45.53
DM  (via drill 0.6)
  Top 0.406: U6.3 94.49,53.36 v94.45,53.33 | R11.1 v29.9,53.33
  Bottom 0.406: v29.9,53.33 v94.45,53.33
DP  (via drill 0.6)
  Top 0.406: U6.4 93.7,55.48 v93.1,54.88 | 30.95,54.88 v31,54.88 R10.1
  Bottom 0.406: v31,54.88 v93.1,54.88
GND  (via drill 0.3)
  Top 0.152: C12.2 50.4,28.93 v50.4,27.72 | C11.2 48.5,27.88 47.95,27.88 v47.95,27.72 | X2.P41 83.6,16.97 83.7,16.88 84.75,16.88 84.8,16.93 X2.P35 | X1.P$2 54.7,18.12 55,17.82 56.65,17.82 X1.2 | C5.2 54.2,51.53 v53.8,51.93 | v48.9,52.23 48.9,51.62 48.7,51.43 47.75,51.43 C4.2 | X2.P54 81.2,15.82 80,15.82 X2.P60 | U1.5 U1.4 57.87,35.43 57.1,35.43 56.9,35.23 56.9,34.23 57.14,33.98 U1.1
  Bottom 0.152: v50.4,27.72 50.35,27.72 50.35,27.93 | v47.95,27.72 48,27.82 48,27.52 | v53.8,51.93 53.2,52.53 49.2,52.53 v48.9,52.23
  other vias: 53.9,27.68 56.7,43.23 56.7,44.03 56.7,44.83 55.2,46.53 76.15,19.57 78.15,20.07 79,20.07 76.15,20.38 49.75,35.73 50.75,35.73 51.55,35.73 48.9,35.73 63.05,21.52 63.05,20.72 63.05,19.88 63.05,19.02 77.65,26.32 78.4,26.32 77.65,25.62 78.4,25.62 98,17.02 97.2,17.02 97.2,16.22 98,16.22 78.05,32.38 78.75,32.38 78.75,31.68 78.05,31.68 67.25,45.33 68.1,45.33 68.1,44.53 67.25,44.53 94.05,15.52 94.05,17.07 94.05,16.32 45.55,27.68 87.4,45.28 87.4,44.48 41.05,32.88 41.8,32.88 41.05,32.18 41.8,32.18 95.95,48.93 95.95,49.62 95.2,49.62 95.2,48.93
  pour Bottom: -0.05,67.03 100,67.03 100,11.43 0.05,11.43
  pour Top: -0.05,67.03 100,67.03 100,11.43 0.05,11.43
GREEN0
  Top 0.152: U1.20 57.95,43.48 58.75,43.48 58.95,43.28 60.2,43.28 64.15,47.23 69,47.23 84.6,31.62 84.6,19.82 86,18.43 X2.P29
GREEN1  (via drill 0.3)
  Top 0.152: X2.P28 86.4,13.52 86.55,13.38 86.55,12.57 v87.1,12.02 | v59.3,43.83 59.15,43.98 57.95,43.98 U1.21 | v69.35,33.58 69.35,16.72 v69.55,16.52
  Bottom 0.152: v87.1,12.02 86.55,12.57 86.55,13.38 84.85,15.02 73.3,15.02 71.8,16.52 v69.55,16.52 | v59.3,43.83 59.75,43.38 60.25,43.38 62.25,41.38 62.5,41.38 66.7,37.12 66.7,36.18 v69.35,33.58
GREEN2
  Top 0.152: X2.P27 86.4,18.57 85,19.97 85,31.82 69.1,47.73 63.6,47.73 60.35,44.47 U1.22
GREEN3  (via drill 0.3)
  Top 0.152: X2.P26 86.8,13.57 87.1,13.27 v87.1,12.88 | v59.1,45.03 57.95,44.98 U1.23 | v68.5,35.33 68.5,17.57 v68.7,17.38
  Bottom 0.152: v87.1,12.88 87.1,13.38 85.05,15.38 73.55,15.38 71.55,17.38 v68.7,17.38 | v59.1,45.03 60.2,43.88 60.5,43.88 67.1,37.28 67.1,36.68 68.45,35.33 v68.5,35.33
GREEN4  (via drill 0.3)
  Top 0.152: X2.P24 87.2,14.07 v87.35,13.98 | v59.95,45.08 59.4,45.62 58.9,45.62 58.75,45.48 57.95,45.48 U1.24 | v67.65,37.18 67.65,18.43 v67.85,18.22
  Bottom 0.152: v87.35,13.98 87,13.98 85.3,15.73 73.65,15.73 71.15,18.22 v67.85,18.22 | v59.95,45.08 59.95,44.93 60.4,44.48 v67.65,37.18
GREEN5
  Top 0.152: X2.P23 87.2,18.22 85.35,20.07 85.35,32.08 69.15,48.28 58.9,48.28 58.5,47.88 58.5,46.03 57.98,46.03 U1.25
GREEN6  (via drill 0.3)
  Top 0.152: v87.9,12.73 87.9,12.88 87.6,13.18 87.6,13.43 87.9,13.73 87.9,14.23 87.6,14.52 X2.P22 | v55,35.03 55.2,35.03 55.65,35.48 55.65,45.93 56.2,46.53 56.2,47.68 U1.26 | v74.1,29.18 v74.1,16.27
  Bottom 0.152: v87.9,12.73 87.9,12.88 87.6,13.18 87.6,13.43 87.9,13.73 87.9,14.23 87.55,14.57 86.9,14.57 85.4,16.07 74.3,16.07 v74.1,16.27 | v55,35.03 64.6,35.03 70.45,29.18 v74.1,29.18
GREEN7
  Top 0.152: X2.P21 87.6,18.27 85.7,20.18 85.7,32.28 69.3,48.68 55.95,48.68 55.75,48.48 55.75,47.73 U1.27
HSYNC  (via drill 0.3)
  Top 0.152: X2.P44 83.2,14.43 82.8,14.02 v82.8,12.12 | v45.65,33.62 45.65,46.48 45.2,46.93 45.2,47.68 U1.48 45.2,47.73 45.2,48.03 45.3,48.12 45.3,48.62 v45,48.93 | v63.45,12.88 64,13.43 v64,29.18 | HSYNC.TP 40.5,50.53 40.5,50.33 41,49.83 v41,49.53
  Bottom 0.152: v82.8,12.12 64.25,12.12 64.05,12.32 v63.45,12.88 | v45.65,33.62 47.25,32.02 60.7,32.02 61.2,31.52 61.6,31.52 61.65,31.47 v64,29.18 | v41,49.53 44.4,49.53 v45,48.93
LEDA  (via drill 0.3)
  Top 0.152: v81.3,29.18 81.3,19.97 80.8,19.47 80.8,18.57 81.55,17.82 81.55,17.77 81.6,17.72 X2.P51 | v97.45,28.57 97.45,28.43
  Top 0.3: C2.1 97.45,28.43 U2.9
  Bottom 0.152: v97.45,28.57 96.75,29.27 81.4,29.27 v81.3,29.18
LEDK  (via drill 0.3)
  Top 0.152: v92.25,18.38 92.25,24.52 93,25.27 93.45,25.27 R1.2 | X2.P50 82,14.52 80.8,13.32 78,13.32 76.1,15.32 76.1,18.32 v76.15,18.32
  Top 0.3: U2.5 93.6,25.32 93.55,25.27 93.6,25.22 R1.2
  Bottom 0.152: v92.25,18.38 92.2,18.32 v76.15,18.32
MISO  (via drill 0.3)
  Top 0.152: U6.11 88.11,51.44 88.1,51.43 88.1,51.12 88,51.03 88,48.83 86.9,47.73 86.9,46.53 86.45,46.08 86.45,37.03 86.9,36.58 v86.9,35.33 | v82,22.32 v82,30.43 | X2.P4 91.2,14.62 91.5,14.32 94.1,14.32 94.85,15.07 94.85,18.68 v94.6,18.93
  Bottom 0.152: v94.6,18.93 90,18.93 88.1,20.82 83.2,20.82 82,22.02 v82,22.32 | v82,30.43 v86.9,35.33
MOSI  (via drill 0.3)
  Top 0.152: 88.9,50.33 U6.10 | 88.9,50.33 | v83,22.32 v83,30.43 | X2.P5 90.8,19.72 v89,21.52 | 88.9,50.33 88.9,49.53 v88.6,49.23 | v86.25,46.83 86.1,46.68 86.1,36.43 v86.3,36.23
  Bottom 0.152: v83,22.32 83,22.22 83.3,21.93 88.6,21.93 v89,21.52 | v86.25,46.83 v88.6,49.23 | v86.3,36.23 86.8,36.23 87.6,35.43 87.6,35.03 v83,30.43
N$1
  Top 0.3: U2.1 93.6,31.51 L1.1
N$2
  Top 0.3: U2.10 96.55,31.51 L1.2
N$3
  Top 0.152: U1.100 56.19,31.48 57.9,29.77 R12.1
N$4  (via drill 0.3)
  Top 0.3: R2.2 R3.1 95.4,38.12 v95.35,38.08 | v91.65,27.57 92,27.93 U2.3 | v89.4,27.68 89.4,36.38 v91.1,38.08
  Bottom 0.3: v91.65,27.57 91.55,27.47 89.6,27.47 v89.4,27.68 | v91.1,38.08 v95.35,38.08
N$6
  Top 0.3: R3.2 95.5,36.83 95.35,36.98 Q1.3
N$7  (via drill 0.3)
  Top 0.152: S1.3 85.8,62.43 85.8,62.03 85.4,61.62 v85.4,61.23 85.4,57.33 85.2,57.12 85.2,56.03 85.4,55.83 86.4,55.83 U6.13 | v82.6,61.23 82.2,61.62 82.2,62.43 S1.1 81.4,62.43 81.3,62.53 81.3,62.62 80.6,63.33 80.6,63.83 80.3,63.83 R7.1
  Bottom 0.152: v85.4,61.23 v82.6,61.23
N$8  (via drill 0.3)
  Top 0.152: v87.2,60.98 87.2,60.73 87,60.53 87,56.62 U6.12 | v95.6,61.73 95.6,62.62 95.8,62.62 R13.2
  Bottom 0.152: v87.2,60.98 87.95,61.73 v95.6,61.73
N$9
  Top 0.152: R13.1 LED1.A
N$10
  Top 0.152: 61.75,38.03 R9.1 61.4,37.93 59.15,37.93 59,37.78 59,37.03 58.95,36.98 57.95,36.98 U1.7
N$11
  Top 0.152: U1.99 55.71,31.26 56.65,30.32 R8.1
N$14
  Top 0.406: U6.16 84.14,53.41 XT1.X2 80.38,56.98 C31.2
N$16
  Top 0.406: U6.17 80.61,52.62 XT1.X1 80.45,52.78 C30.2
N$17
  Top 0.305: X1.P$18 46.65,21.07 46.3,21.43 45.4,21.43 44,22.82 R18.1
N$19  (via drill 0.3)
  Top 0.152: 60.45,36.47 C9.1 60.24,36.47 U1.6 | U1.38 C7.1 | U1.67 | 36.25,40.12 C20.+
  Top 0.3: U1.67 C8.1 39.95,39.23 39.4,39.78 v39.45,39.83 39.4,39.93 v39.4,41.98 | v36.25,41.93 36.25,40.12 | L3.2 33,41.73 v33.2,41.93 | v50.45,43.28 50.45,46.62 50.25,46.83 50.25,46.98 50.2,47.03 U1.38 | v59.6,37.28 59.7,37.18
  Top 0.305: 59.7,37.18 60.35,37.18 C9.1
  Bottom 0.3: v36.25,41.93 36.3,41.98 | v33.2,41.93 v36.25,41.93 | 47.5,40.33 v50.45,43.28 | 47.5,40.33 40.2,40.33 39.85,39.98 39.5,39.98 39.45,39.93 v39.45,39.83 | v59.6,37.28 59.45,37.12 58.65,37.12 57.95,37.83 57.95,38.73 57.25,39.43 56.35,39.43 55.55,40.23 47.6,40.23 47.5,40.33 | v39.4,41.98 36.5,41.98 36.45,41.93 v36.25,41.93
N$20  (via drill 0.3)
  Top 0.152: U1.78 | C6.1 | C5.1 | C4.1 | U1.57 | 39.95,43.03 C3.1
  Top 0.3: C25.1 44.75,30.57 45.2,31.02 U1.78 | v59.15,42.46 U1.18 | v59.15,42.46 C6.1 | 54.7,49.12 U1.29 | 54.7,49.12 C5.1 | 47.71,48.93 U1.43 47.7,47.62 47.7,47.03 47.75,46.98 47.75,46.83 47.85,46.73 v47.85,46.48 | 47.71,48.93 C4.1 | C3.1 U1.57 | v36.1,48.38 C21.+ | 39.95,43.03 v39.95,46.38 39.95,48.43 v39.9,48.48 | L2.2 33,48.23 v33.15,48.38 | v54.75,49.12 54.7,49.12 | 47.71,48.93 v47.75,48.93 | v59.15,42.48 v59.15,42.46 | v44.65,46.38 44.7,46.28 44.7,33.68 45.2,33.18 45.2,32.38 U1.78
  Bottom 0.3: v33.15,48.38 v36.1,48.38 36.2,48.43 36.25,48.43 36.3,48.48 v39.9,48.48 | 44.65,46.48 v47.85,46.48 47.85,46.38 47.9,46.33 48.25,46.33 48.6,45.98 49.05,45.98 52.55,42.48 v59.15,42.48 | 44.65,46.48 39.9,46.48 v39.95,46.38 | v54.75,49.12 53.9,48.28 48.4,48.28 v47.75,48.93 | v44.65,46.38 44.65,46.48
N$21  (via drill 0.3)
  Top 0.152: C14.1 53.7,30.42 v53.7,31.07 | v47.85,30.97 47.9,30.97 | U1.84 | 47.4,30.27 C10.1 | L4.2 33.15,33.62 | 50.2,30.52 50.2,30.38 C12.1 50.35,30.38 50.2,30.52
  Top 0.3: 53.7,30.42 U1.95 | U1.88 v50.2,30.97 50.2,30.52 | 47.9,30.97 48.2,31.27 U1.84 | U1.82 47.2,31.17 47.4,30.97 | 47.4,30.97 v47.85,30.97 48.4,30.97 48.5,30.88 C11.1 | 47.4,30.97 47.4,30.27 | v37.6,33.62 C18.+ 33.15,33.62
  Bottom 0.152: v50.2,30.97 50.2,31.07
  Bottom 0.3: v50.2,30.97 v47.85,30.97 37.6,30.97 v37.6,33.62 | 50.2,31.07 v53.7,31.07
N$22  (via drill 0.3)
  Top 0.152: 54.7,30.73 U1.97 | 54.7,30.73 C17.1 | 54.7,30.73 54.7,31.02 v55.2,31.02 | C19.+ 34.35,27.12 | L5.2 33.2,27.12
  Top 0.3: v36.4,28.62 36.4,28.38 36.35,28.32 36.35,27.97 36.25,27.88 C19.+
  Top 0.5: 33.2,27.12 C19.+
  Bottom 0.3: v55.2,31.02 55,31.02 53.9,29.93 42.65,29.93 41.35,28.62 v36.4,28.62
N$31
  Top 0.305: X1.P$19 44.94,19.84 R18.2
NCS  (via drill 0.3)
  Top 0.152: X2.P8 90.4,14.32 90.8,13.93 94.4,13.93 95.2,14.73 v95.2,20.12 | v91,22.43 88.85,24.57 88.85,35.18 88.1,35.93 v88.1,42.53 | v90.4,50.93 90.4,58.14 U6.8
  Bottom 0.152: v95.2,20.12 91.5,20.12 91,20.62 v91,22.43 | v90.4,50.93 90.4,48.33 88.7,46.62 88.7,43.12 v88.1,42.53
NPOWERDOWN  (via drill 0.3)
  Top 0.152: U1.2 58.96,34.46 59.1,34.33 v59.1,27.52 | U6.32 | U6.32 95.3,46.93 v95.3,41.83
  Bottom 0.152: v59.1,27.52 88.2,27.52 90.1,25.62 99.1,25.62 99.5,26.02 99.5,40.33 98.7,41.12 96,41.12 v95.3,41.83
PDO  (via drill 0.3)
  Top 0.152: v92.25,42.98 92.55,43.28 92.55,45.12 92.9,45.48 92.9,46.98 U6.29 | v67.6,38.03 67.35,38.03 v66.1,36.78 | v53.9,38.38 v53.9,44.38 | v56.7,38.38 57.15,37.93 57.2,37.98 57.9,37.98 U1.9
  Bottom 0.152: v92.25,42.98 89.65,40.38 89.65,40.28 87.15,37.78 80.85,37.78 77.15,34.08 71.95,34.08 68,38.03 v67.6,38.03 | v66.1,36.78 62.05,40.88 61.85,40.88 60.95,41.78 60.95,41.83 60.6,42.18 60.55,42.18 60.2,42.53 59.9,42.53 59.35,43.08 59.3,43.08 59.1,43.28 59.05,43.28 56.95,45.38 56.45,45.38 55.45,44.38 v53.9,44.38 | v56.7,38.38 v53.9,38.38
RED0
  Top 0.152: X2.P19 88,18.38 86.05,20.32 86.05,32.48 69.35,49.18 56.1,49.18 55.65,49.62 55.65,50.62 55.45,50.83 53.9,50.83 53.8,50.73 53.8,49.03 54.19,48.64 U1.30
RED1  (via drill 0.3)
  Top 0.152: v88.5,12.12 88.5,12.93 88.25,13.18 88.25,14.38 88.4,14.52 X2.P18 | v54.95,35.88 55.2,36.12 55.2,45.43 54.1,46.53 54.1,46.58 53.7,46.98 53.7,47.68 U1.31 | v59.7,35.68 59.7,34.98 v60.2,34.48 | v67,19.07 v67,29.12
  Bottom 0.152: v88.5,12.12 88.5,12.93 88.25,13.18 88.25,14.38 87.7,14.93 87.1,14.93 85.55,16.47 74.75,16.47 72.15,19.07 v67,19.07 | v54.95,35.88 59.5,35.88 v59.7,35.68 | v60.2,34.48 60.4,34.68 64.5,34.68 67,32.18 v67,29.12
RED2
  Top 0.152: X2.P17 88.4,18.47 86.4,20.47 86.4,32.62 69.45,49.58 56.5,49.58 56.05,50.03 56.05,52.53 55.9,52.68 53.6,52.68 53.25,52.33 53.25,47.75 U1.32
RED3  (via drill 0.3)
  Top 0.152: X2.P16 88.8,14.38 88.6,14.18 88.6,13.82 v88.85,13.57 | v54.55,36.73 54.55,45.12 52.7,46.98 52.7,47.68 U1.33 | v61,35.58 61,35.53 61.1,35.43 v61.1,34.12 | v66.45,31.93 66.5,31.88 66.5,29.82 66.15,29.47 66.15,20.22 v65.85,19.93
  Bottom 0.152: v88.85,13.57 88.6,13.82 88.6,14.18 88.8,14.38 88.8,14.77 88.2,15.38 87.15,15.38 85.7,16.82 74.95,16.82 71.85,19.93 v65.85,19.93 | v54.55,36.73 59.85,36.73 v61,35.58 | v61.1,34.12 61.3,34.33 64.4,34.33 66.45,32.28 v66.45,31.93
RED4  (via drill 0.3)
  Top 0.152: X2.P14 89.2,14.07 89.4,13.88 89.4,13.32 89.1,13.02 v89.1,12.77 | v53.55,45.18 52.1,46.62 52.1,46.83 52.2,46.93 52.2,47.68 U1.34 | v64,30.02 v64,41.83 | v65.5,20.77 v65.5,29.12
  Bottom 0.152: v89.1,12.77 89.1,13.02 89.4,13.32 89.4,13.88 89.15,14.12 89.15,14.88 88.3,15.73 87.25,15.73 85.75,17.22 75.2,17.22 71.65,20.77 v65.5,20.77 | v64,41.83 60.1,45.73 56.35,45.73 55.8,45.18 v53.55,45.18 | v64,30.02 64.9,29.12 v65.5,29.12
RED5
  Top 0.152: X2.P13 89.2,18.18 86.75,20.62 86.75,32.78 69.5,50.03 56.8,50.03 56.55,50.28 56.55,52.73 56.2,53.08 52.25,53.08 51.75,52.58 51.75,47.75 U1.35
RED6  (via drill 0.3)
  Top 0.152: X2.P12 89.6,14.18 89.75,14.02 89.75,12.38 v89.5,12.12 | v51.45,46.48 51.45,46.68 51.2,46.93 51.2,47.68 U1.36 | v64.85,42.12 64.85,28.68 64.8,28.62 64.8,21.68 v64.85,21.62
  Bottom 0.152: v89.5,12.12 89.75,12.38 89.75,14.77 88.45,16.07 87.35,16.07 85.85,17.57 75.35,17.62 71.3,21.68 v64.85,21.62 | v51.45,46.48 51.9,46.03 53.65,46.03 54,45.68 55.75,45.68 56.2,46.12 60.35,46.12 60.45,46.03 60.95,46.03 v64.85,42.12
RED7
  Top 0.152: X2.P11 89.6,18.27 87.15,20.72 87.15,32.88 69.65,50.38 57.25,50.38 57,50.62 57,52.98 56.45,53.53 51.75,53.53 51.1,52.88 51.1,49.03 50.75,48.68 50.75,47.74 U1.37
RESET  (via drill 0.3)
  Top 0.152: X2.P9 90,18.43 87.6,20.82 87.6,33.03 85.6,35.03 85.6,47.43 v85.65,47.48 | U6.1 96.1,54.93 96.05,54.88 96.05,54.68 95.5,54.12 95.5,52.93 v94.35,51.78
  Bottom 0.152: v94.35,51.78 89.95,51.78 v85.65,47.48
S3  (via drill 0.3)
  Top 0.152: X2.P57 80.4,17.93 80.1,18.22 80.1,19.82 80.6,20.32 80.6,28.52 80.3,28.82 v80.3,33.73 | v84.65,36.43 84.65,43.78 83.2,45.23 v83.2,46.83 | v85.25,50.28 85.45,50.28 85.5,50.23 86.45,50.23 U6.20
  Bottom 0.152: v80.3,33.73 81.95,33.73 v84.65,36.43 | v83.2,46.83 84.5,48.12 85.1,48.12 86.05,49.08 86.05,49.78 85.55,50.28 v85.25,50.28
S4  (via drill 0.3)
  Top 0.152: X2.P59 80,17.82 79.75,18.07 79.75,19.93 80.25,20.43 80.25,28.38 79.9,28.72 79.9,33.18 79.4,33.68 v79.4,34.03 | v92.9,42.43 92.9,45.03 93.7,45.83 93.7,46.93 U6.30
  Bottom 0.152: v92.9,42.43 87.6,37.12 82.5,37.12 v79.4,34.03
SCDT  (via drill 0.3)
  Top 0.152: U1.8 56.74,37.49 v56.7,37.53 | v38.2,36.23 37.5,36.93 37.5,53.43 38.35,54.28 | 38.35,54.28 38.5,54.43 | U6.26 90.5,49.33 91.3,50.12 91.3,53.93 v91.1,54.12 | v38.4,54.12 38.4,54.23 38.35,54.28
  Bottom 0.152: v56.7,37.53 42.8,37.53 41.5,36.23 v38.2,36.23 | v38.4,54.12 v91.1,54.12
SCL  (via drill 0.3)
  Top 0.152: X2.P55 80.8,18.12 80.45,18.47 80.45,19.68 80.95,20.18 80.95,28.68 80.7,28.93 80.7,32.93 80.9,33.12 80.9,33.98 78.55,36.33 v78.2,36.33 | 80.05,49.03 R5.2 80.2,49.08 v81.1,49.08 | v81.85,39.83 82.1,40.08 82.1,44.48 80.15,46.43 v80.15,46.48 | v85.25,51.68 85.4,51.83 86.45,51.83 U6.18
  Top 0.406: R5.2 80.15,48.98
  Bottom 0.152: v78.2,36.33 78.3,36.33 81.8,39.83 v81.85,39.83 | v80.15,46.48 81.1,47.43 v81.1,49.08 81.15,49.12 81.35,49.12 83.9,51.68 v85.25,51.68
SCL_BB  (via drill 0.3)
  Top 0.152: v85.2,49.43 U6.21 | v85.2,49.43 | v48.2,17.43 X1.P$15 | v39.9,17.43 39.15,17.43 R14.2 | v79,41.93 v79,44.43 | v75.95,38.68 76,38.62 v76,25.62
  Bottom 0.152: v76,25.62 58.1,25.62 57.9,25.43 57.9,24.62 55.9,22.62 55.9,17.62 55.7,17.43 v48.2,17.43 v39.9,17.43 | v85.2,49.43 84.05,49.43 v79,44.43 | v79,41.93 79,41.73 v75.95,38.68
SCLK  (via drill 0.3)
  Top 0.152: X2.P7 90.4,18.52 87.95,20.97 87.95,33.48 v87.5,33.93 | 89.6,48.43 v89.5,48.33 89.71,48.54 U6.9 | v88.8,40.62 88.8,36.83 88.7,36.73 v88.7,36.33
  Bottom 0.152: v89.5,48.33 88.35,47.18 88.35,43.62 87.5,42.78 87.5,41.93 v88.8,40.62 | v88.7,36.33 88.7,35.03 v87.5,33.93
SDA  (via drill 0.3)
  Top 0.152: R6.2 83.45,48.93 | X2.P56 80.8,14.32 80.2,13.73 78.2,13.73 76.8,15.12 76.8,17.93 77.2,18.32 77.2,21.43 79.9,24.12 79.9,28.12 79.5,28.52 79.5,30.72 v79.3,30.93 | v84.5,48.73 84.2,49.03 83.7,49.03 R6.2 | v80.4,40.43 v80.4,44.03 | v77.4,37.23 77.4,31.32 77.5,31.22 v77.5,30.93 | U6.19 86.3,51.03 84.45,51.03 83.5,50.08 R6.2
  Top 0.406: U6.19
  Bottom 0.152: v84.5,48.73 84.2,48.73 80.4,44.93 v80.4,44.03 | v80.4,40.43 80.4,40.23 v77.4,37.23 | v79.3,30.93 v77.5,30.93
SDA_BB  (via drill 0.3)
  Top 0.152: X1.P$16 47.65,16.77 v48.2,16.22 48,16.02 38.3,16.02 37.6,16.72 R15.2 | U6.22 86.47,48.62 85.3,48.62 84.8,48.12 v84.8,47.58 | v81.25,44.08 81.25,41.48 v81.05,41.28 | v76.55,37.78 76.8,37.53 v76.8,24.52
  Bottom 0.152: v48.2,16.22 55.6,16.22 56.4,17.02 56.4,22.43 58.5,24.52 v76.8,24.52 | v84.8,47.58 84.75,47.58 v81.25,44.08 | v81.05,41.28 80.75,41.28 80.65,41.38 80.3,41.38 80.2,41.28 80.05,41.28 v76.55,37.78
ST  (via drill 0.3)
  Top 0.152: U1.3 57.95,34.98 58.9,34.98 59.95,33.93 60.45,33.93 61.1,33.28 61.45,33.28 v61.55,33.18 | v71.75,35.18 v71.75,32.98 | v90.65,39.28 v90.65,43.78 | v91.85,43.78 92.1,44.03 U6.28 | v65.5,40.12 65.5,37.73 65.2,37.43 65.2,35.62 65.5,35.33 v65.5,32.43
  Bottom 0.152: v61.55,33.18 63.85,33.18 64.6,32.43 v65.5,32.43 | 65.5,40.28 66.65,40.28 v71.75,35.18 | 65.5,40.28 65.4,40.28 | v71.75,32.98 79.85,32.98 79.95,32.88 82.3,32.88 85.5,36.08 85.5,36.23 86.05,36.78 87.7,36.78 88.1,37.18 88.55,37.18 v90.65,39.28 | v90.65,43.78 v91.85,43.78 | v65.5,40.12 65.5,40.28
TMDS_CLOCK+  (via drill 0.3)
  Top 0.152: X1.P$10 50.7,21.43 54.25,24.97 55.75,24.97 v56.6,24.12 | U1.93 52.69,31.21 52.55,31.07 52.55,25.27 v52.25,24.97
  Bottom 0.152: v52.25,24.97 55.75,24.97 v56.6,24.12
TMDS_CLOCK-  (via drill 0.3)
  Top 0.152: X1.P$12 49.7,20.93 54.1,25.32 56.55,25.32 v57.1,24.77 | v53.15,25.52 53.15,31.32 53.25,31.43 53.25,32.2 U1.94
  Bottom 0.152: v57.1,24.77 56.35,25.52 v53.15,25.52
TMDS_DATA0+  (via drill 0.3)
  Top 0.152: v52.05,21.93 52.2,21.77 X1.P$7 | v48.05,21.68 48.15,21.88 48.85,21.88 50.9,23.93 50.9,24.68 50.8,24.77 50.4,24.77 50.25,24.93 50.25,25.32 50.4,25.47 51.1,25.47 51.2,25.57 51.2,25.93 51.1,26.02 50.3,26.02 50.2,26.12 50.2,26.57 50.35,26.72 51.1,26.72 51.2,26.82 51.2,32.24 U1.90
  Bottom 0.152: v52.05,21.93 51.95,21.88 48.15,21.88 v48.05,21.68
TMDS_DATA0-  (via drill 0.3)
  Top 0.152: X1.P$9 51.2,20.88 v51.55,21.32 | v47.25,21.77 47.7,21.12 48.95,21.12 51.7,23.88 51.7,24.12 51.6,24.22 51.4,24.22 51.25,24.38 51.25,25.12 51.35,25.22 51.55,25.22 51.7,25.38 U1.91
  Bottom 0.152: v47.25,21.77 47.6,21.27 47.7,21.12 49.2,21.12 49.4,21.32 v51.55,21.32
TMDS_DATA1+  (via drill 0.3)
  Top 0.152: X1.P$4 53.7,22.68 54.25,23.22 54.8,23.22 v55.2,23.62 | v48.4,23.38 48.55,23.38 49.2,24.02 49.2,30.72 48.7,31.22 U1.85
  Bottom 0.152: v48.4,23.38 48.6,23.18 54.35,23.18 54.8,23.62 v55.2,23.62
TMDS_DATA1-  (via drill 0.3)
  Top 0.152: X1.P$6 52.7,22.68 54.45,24.43 v55.35,24.43 | v49.7,23.72 49.7,23.97 49.55,24.12 49.55,30.93 49.2,31.27 49.2,32.24 U1.86
  Bottom 0.152: v55.35,24.43 54.95,24.43 54.05,23.52 49.9,23.52 v49.7,23.72
TMDS_DATA2+  (via drill 0.3)
  Top 0.152: v55.2,22.82 X1.P$1 | v46.2,22.88 46.2,32.24 U1.80
  Bottom 0.152: v55.2,22.82 46.2,22.82 v46.2,22.88
TMDS_DATA2-  (via drill 0.3)
  Top 0.152: v54.45,22.27 54.45,22.18 54.2,21.97 X1.P$3 | v46.4,22.12 46.75,22.47 46.75,23.22 46.6,23.38 46.6,30.88 46.7,30.97 U1.81
  Bottom 0.152: v46.4,22.12 46.75,22.47 54.25,22.47 v54.45,22.27
UCAP
  Top 0.406: U6.6 92.1,59.23 93.4,60.53 C29.1
VBUS  (via drill 0.3, 0.6)
  Top 0.3: 92.7,28.43 U2.2 | 92.7,28.43 91.85,28.43 C1.1 | v92.7,28.57 92.7,28.43 | v96.5,26.32 96.5,26.93 U2.6 96.55,27.07 U2.7 | v41.7,30.18 43.3,28.57 43.3,27.93 v43.2,27.82 | X4.1 23.45,16.05
  Top 0.4: C13.+ 59.9,61.62 59.85,61.68
  Top 0.406: U5.3 C15.1 | U6.2 | 28.1,21.27 28.1,21.12 29.3,19.93 X3.1
  Top 0.5: 28.1,22.12 28.1,21.27 | 28.1,22.12 v28.1,30.18 28.1,58.08 31.7,61.68 59.85,61.68 70.15,61.68 71.3,60.53 71.3,60.12 | 71.3,60.12 U5.3 | 71.3,60.12 v73.65,60.12 | v95.3,60.12 U6.2 | U6.7 91.31,60.04 v91.4,60.12 | 28.1,22.12 25.2,22.12 23.45,20.38 23.45,16.05
  Bottom 0.3: 92.7,28.43 43.85,28.47 v43.2,27.82 | v96.5,26.32 94.9,27.93 93.15,27.93 92.7,28.43 | 92.7,28.43 v92.7,28.57
  Bottom 0.406: v28.1,30.18 v41.7,30.18
  Bottom 0.5: v95.3,60.12 v91.4,60.12 v73.65,60.12
VDD  (via drill 0.3, 0.4, 0.6)
  Top 0.152: L5.1 33.25,24.93 | R12.2 57.9,26.72 v58.2,26.43 | v63,26.43 63.1,26.32 | v34.4,24.93 34.4,23.62 37.6,20.43 R15.1 R14.1 | 80.1,59.83 80.1,62.53 80.2,62.53 R7.2
  Top 0.2: X2.P46 82.8,14.68 81.05,12.93 77.9,12.93 75.1,15.73 v75.1,19.38 | X2.P47 82.4,17.93 v81.4,18.93 | X2.P58 80.4,14.43 80.1,14.12 78.3,14.12 77.2,15.23 77.2,17.72 78,18.52 v78,18.93
  Top 0.3: 63.1,26.32 v63.1,22.43 | R6.1 R5.1 78.05,47.68 v74.6,51.12
  Top 0.305: R9.2 63.05,26.47 v63,26.43 | 56.65,27.27 56.65,26.68 56.9,26.43 v58.2,26.43
  Top 0.406: U6.44 98.81,56.61 99.3,56.12 | 99.3,56.12 99.45,55.98 99.45,49.28 98.85,48.68 97.75,48.68 U6.34 98.1,48.25 C26.1 v96.9,44.73 | 73.35,64.53 C16.1 | U6.24 C28.1 89,44.73 v89.8,44.73 | U6.14 84.51,55.01 83.7,55.83 | 83.7,55.83 82.6,56.93 82.6,58.73 81.5,59.83 80.1,59.83 77.8,59.83 C27.1 | 32.3,31.52 32.4,31.52 32.95,31.52 L4.1 | 32.25,38.08 L3.1 | L2.1 32.95,44.83 32.2,44.83 31.8,45.23 | R4.2 93.85,44.68 93.9,44.73 v93.8,44.73 | R8.2 56.65,27.27 v56.65,26.52 | 32.2,51.03 v32.2,51.12 | v83.8,56.03 83.8,55.93 83.7,55.83 | v99.2,56.03 99.3,56.12
  Top 0.5: C16.1 U5.4 | v74.6,51.12 74.6,62.03 | 74.6,62.03 73.35,63.28 73.35,64.53 | C27.1 77.75,61.58 77.3,62.03 74.6,62.03 | 32.3,31.52 31.8,31.02 31.8,25.22 32.1,24.93 L5.1 v34.4,24.93 | 32.4,31.52 31.8,32.12 31.8,37.62 32.25,38.08 31.8,38.53 31.8,44.43 32.2,44.83 | 32.2,51.03 31.8,50.62 31.8,45.23
  Bottom 0.152: v63.1,22.43 63.15,22.38
  Bottom 0.2: v81.4,18.93 v78,18.93 75.55,18.93 v75.1,19.38
  Bottom 0.3: v75.1,19.38 74.6,19.38 71.8,22.18 65.2,22.18 65,22.38 63.15,22.38
  Bottom 0.305: v58.2,26.43 v63,26.43
  Bottom 0.406: 36.2,26.72 56.45,26.72 v56.65,26.52 | v83.8,56.03 v99.2,56.03 | v96.9,44.73 v93.8,44.73 v89.8,44.73
  Bottom 0.5: v34.4,24.93 36.2,26.72 | v32.2,51.12 v74.6,51.12
VSYNC  (via drill 0.3)
  Top 0.152: v73.25,34.93 73.25,21.72 v73.5,21.47 | v82.25,18.97 82.8,18.43 X2.P45 | U1.47 45.7,47.73 45.7,48.43 45.8,48.53 v45.8,48.93 45.7,49.03 45.7,49.12 45.6,49.23 45.6,49.33 44.6,50.33 44.6,50.53 VSYNC.TP
  Bottom 0.152: v45.8,48.93 47.4,47.33 55.85,47.33 56.1,47.58 58.25,47.58 58.45,47.38 60.8,47.38 v73.25,34.93 | v73.5,21.47 73.55,21.43 80.05,21.43 80.45,21.02 80.45,20.68 82.15,18.97 v82.25,18.97

### Text on the board
tNames: Reset | Status | Manga Screen | Rev A2 | GND | +5V